# EAGLE design sequencer (EAGLE 6.4)
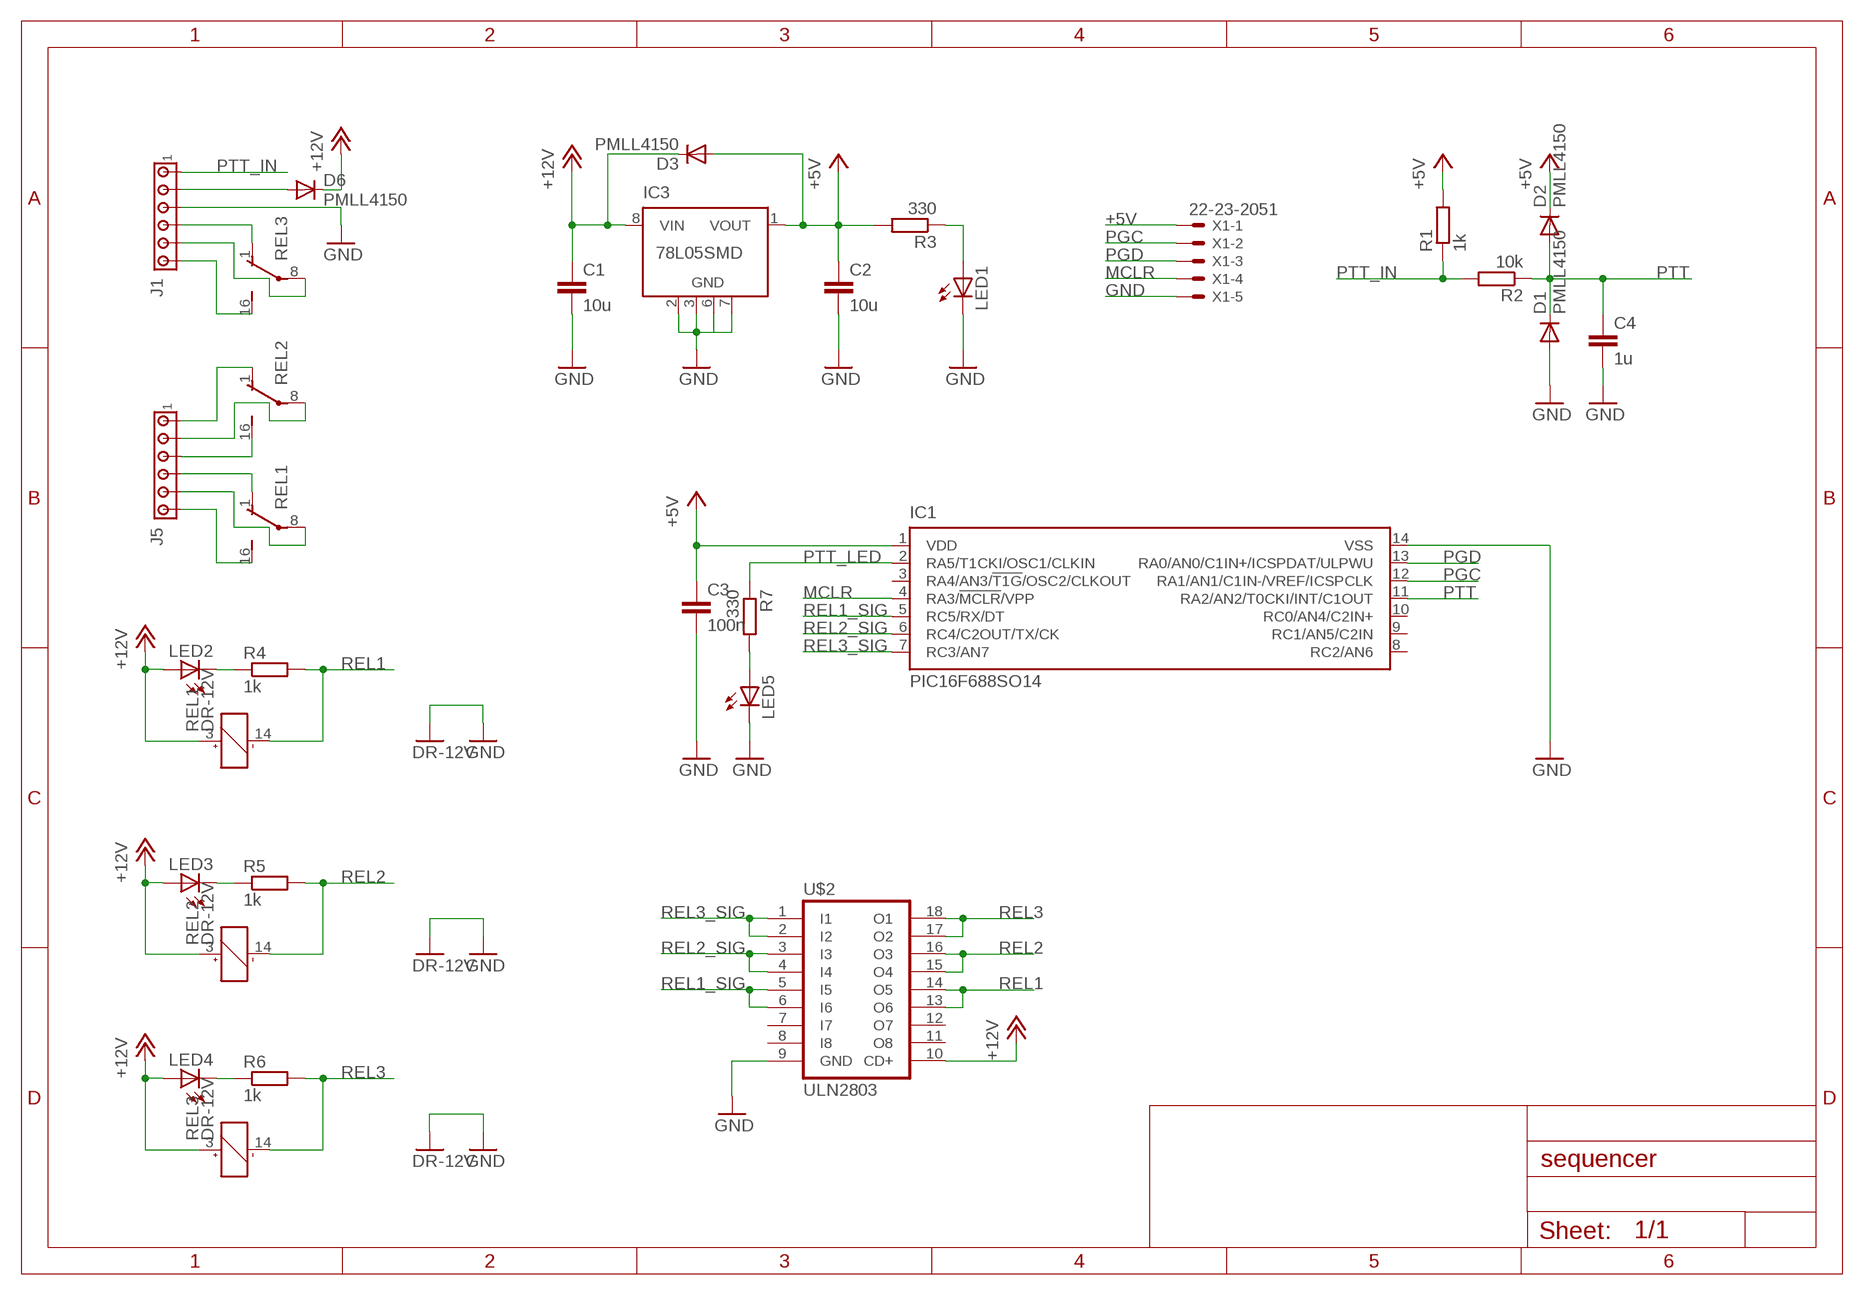
[diagram p0: schematic, sheet 1]

## Parts
C1  10u  CAPACITORC1206  [C1206]
C2  10u  CAPACITORC1206  [C1206]
C3  100n  CAPACITORC1206  [C1206]
C4  1u  CAPACITORC1206  [C1206]
D1  PMLL4150  [SOD80C]
D2  PMLL4150  [SOD80C]
D3  PMLL4150  [SOD80C]
D6  PMLL4150  [SOD80C]
IC1  PIC16F688SO14  [SO14]
IC3  78L05SMD  [SO08]
J1  SL508_6_90SL508_6_90  [SL508_6_90]
J5  SL508_6_90SL508_6_90  [SL508_6_90]
LED1  LEDSMT1206  [1206]
LED2  LEDSMT1206  [1206]
LED3  LEDSMT1206  [1206]
LED4  LEDSMT1206  [1206]
LED5  LEDSMT1206  [1206]
R1  1k  RESISTORR1206  [R1206]
R2  10k  RESISTORR1206  [R1206]
R3  330  RESISTORR1206  [R1206]
R4  1k  RESISTORR1206  [R1206]
R5  1k  RESISTORR1206  [R1206]
R6  1k  RESISTORR1206  [R1206]
R7  330  RESISTORR1206  [R1206]
REL1  DR-12V  [DR-12V]
REL2  DR-12V  [DR-12V]
REL3  DR-12V  [DR-12V]
U$2  ULN2803  [SO18W]
X1  22-23-2051  [22-23-2051]

## Nets
+5V: C2.1 C3.1 D2.C D3.A IC1.1(VDD) IC3.1(VOUT) R1.2 R3.2 X1.1
+12V: C1.1 D3.C D6.C IC3.8(VIN) LED2.A LED3.A LED4.A REL1.3(+) REL2.3(+) REL3.3(+) U$2.10(CD+)
GND: C1.2 C2.2 C3.2 C4.2 D1.A IC1.14(VSS) IC3.2(GND) IC3.3(GND) IC3.6(GND) IC3.7(GND) J1.3 LED1.C LED5.C REL1.9(GND) REL2.9(GND) REL3.9(GND) U$2.9(GND) X1.5
MCLR: IC1.4(RA3/!MCLR!/VPP) X1.4
N$1: J5.3 REL2.16(S)
N$2: J5.2 REL2.8(P)
N$3: J5.1 REL2.1(O)
N$4: J1.5 REL3.8(P)
N$5: J5.5 REL1.8(P)
N$6: J5.6 REL1.16(S)
N$7: J1.6 REL3.16(S)
N$8: J1.4 REL3.1(O)
N$9: D6.A J1.2
N$10: LED1.A R3.1
N$11: LED5.A R7.2
N$12: J5.4 REL1.1(O)
N$13: LED3.C R5.1
N$14: LED2.C R4.1
N$15: LED4.C R6.1
PGC: IC1.12(RA1/AN1/C1IN-/VREF/ICSPCLK) X1.2
PGD: IC1.13(RA0/AN0/C1IN+/ICSPDAT/ULPWU) X1.3
PTT: C4.1 D1.C D2.A IC1.11(RA2/AN2/T0CKI/INT/C1OUT) R2.1
PTT_IN: J1.1 R1.1 R2.2
PTT_LED: IC1.2(RA5/T1CKI/OSC1/CLKIN) R7.1
REL1: R4.2 REL1.14(-) U$2.13(O6) U$2.14(O5)
REL1_SIG: IC1.5(RC5/RX/DT) U$2.5(I5) U$2.6(I6)
REL2: R5.2 REL2.14(-) U$2.15(O4) U$2.16(O3)
REL2_SIG: IC1.6(RC4/C2OUT/TX/CK) U$2.3(I3) U$2.4(I4)
REL3: R6.2 REL3.14(-) U$2.17(O2) U$2.18(O1)
REL3_SIG: IC1.7(RC3/AN7) U$2.1(I1) U$2.2(I2)
Unconnected: IC1.3(RA4/AN3/!T1G!/OSC2/CLKOUT) IC1.8(RC2/AN6) IC1.9(RC1/AN5/C2IN) IC1.10(RC0/AN4/C2IN+) IC3.4(NC) IC3.5(NC) U$2.7(I7) U$2.8(I8) U$2.11(O8) U$2.12(O7)

## Library data of the parts
C1-C4 = 00MyParts:CAPACITOR: CAPACITOR, European symbol
D1-D3 D6 = diode:PMLL4150: DIODE high speed
IC1 = 00MyParts:PIC16F688
IC3 = linear:78L*SMD: Positive VOLTAGE REGULATOR
J1 J5 = 00MyParts:SL508_6_90: AMP connector
LED1-LED5 = led:LED: LED OSRAM: - CHIPLED LG R971, LG N971, LY N971, LG Q971, LY Q971, LO R971, LY R971 LH N974, LH R974 LS Q976, LO Q976, LY Q976 LO Q996 - Hyper CHIPLED LW Q18S LB Q993, LB Q99A, LB R99A - SideLED LS A670, LO A670, LY A670, LG A670, LP A670 LB A673, LV A673, LT A673, LW A673 LH A674 LY A675 LS A676, LA A676, LO A676, LY A676, LW A676 LS A679, LY A679, LG A679 - Hyper Micro SIDELED® LS Y876, LA Y876, LO Y876, LY Y876 LT Y87S - SmartLED LW L88C, LW L88S LB L89C, LB L89S, LG L890 LS L89K, LO L89K, LY L89K LS L896, LA L896, LO L896, LY L896 - TOPLED LS T670, LO T670, LY T670, LG T670, LP T670 LSG T670, LSP T670, LSY T670, LOP T670, LYG T670 LG T671, LOG T671, LSG T671 LB T673, LV T673, LT T673, LW T673 LH T674 LS T676, LA T676, LO T676, LY T676, LB T676, LH T676, LSB T676, LW T676 LB T67C, LV T67C, LT T67C, LS T67K, LO T67K, LY T67K, LW E67C LS E67B, LA E67B, LO E67B, LY E67B, LB E67C, LV E67C, LT E67C LW T67C LS T679, LY T679, LG T679 LS T770, LO T770, LY T770, LG T770, LP T770 LB T773, LV T773, LT T773, LW T773 LH T774 LS E675, LA E675, LY E675, LS T675 LS T776, LA T776, LO T776, LY T776, LB T776 LHGB T686 LT T68C, LB T68C - Hyper Mini TOPLED® LB M676 - Mini TOPLED Santana® LG M470 LS M47K, LO M47K, LY M47K Source: http://www.osram.convergy.de LUXEON: - LUMILED® LXK2-PW12-R00, LXK2-PW12-S00, LXK2-PW14-U00, LXK2-PW14-V00 LXK2-PM12-R00, LXK2-PM12-S00, LXK2-PM14-U00 LXK2-PE12-Q00, LXK2-PE12-R00, LXK2-PE12-S00, LXK2-PE14-T00, LXK2-PE14-U00 LXK2-PB12-K00, LXK2-PB12-L00, LXK2-PB12-M00, LXK2-PB14-N00, LXK2-PB14-P00, LXK2-PB14-Q00 LXK2-PR12-L00, LXK2-PR12-M00, LXK2-PR14-Q00, LXK2-PR14-R00 LXK2-PD12-Q00, LXK2-PD12-R00, LXK2-PD12-S00 LXK2-PH12-R00, LXK2-PH12-S00 LXK2-PL12-P00, LXK2-PL12-Q00, LXK2-PL12-R00 Source: www.luxeon.com KINGBRIGHT: KA-3528ASYC Source: www.kingbright.com
R1-R7 = 00MyParts:RESISTOR: RESISTOR, European symbol
REL1-REL3 = 00MyParts:DR-12V
U$2 = 00MyParts:ULN2803
X1 = 00MyParts:22-23-2051: .100" (2.54mm) Center Header - 5 Pin; MF: MOLEX; MPN: 22-23-2051; OC_FARNELL: 1462952; OC_NEWARK: 38C9178

## Board
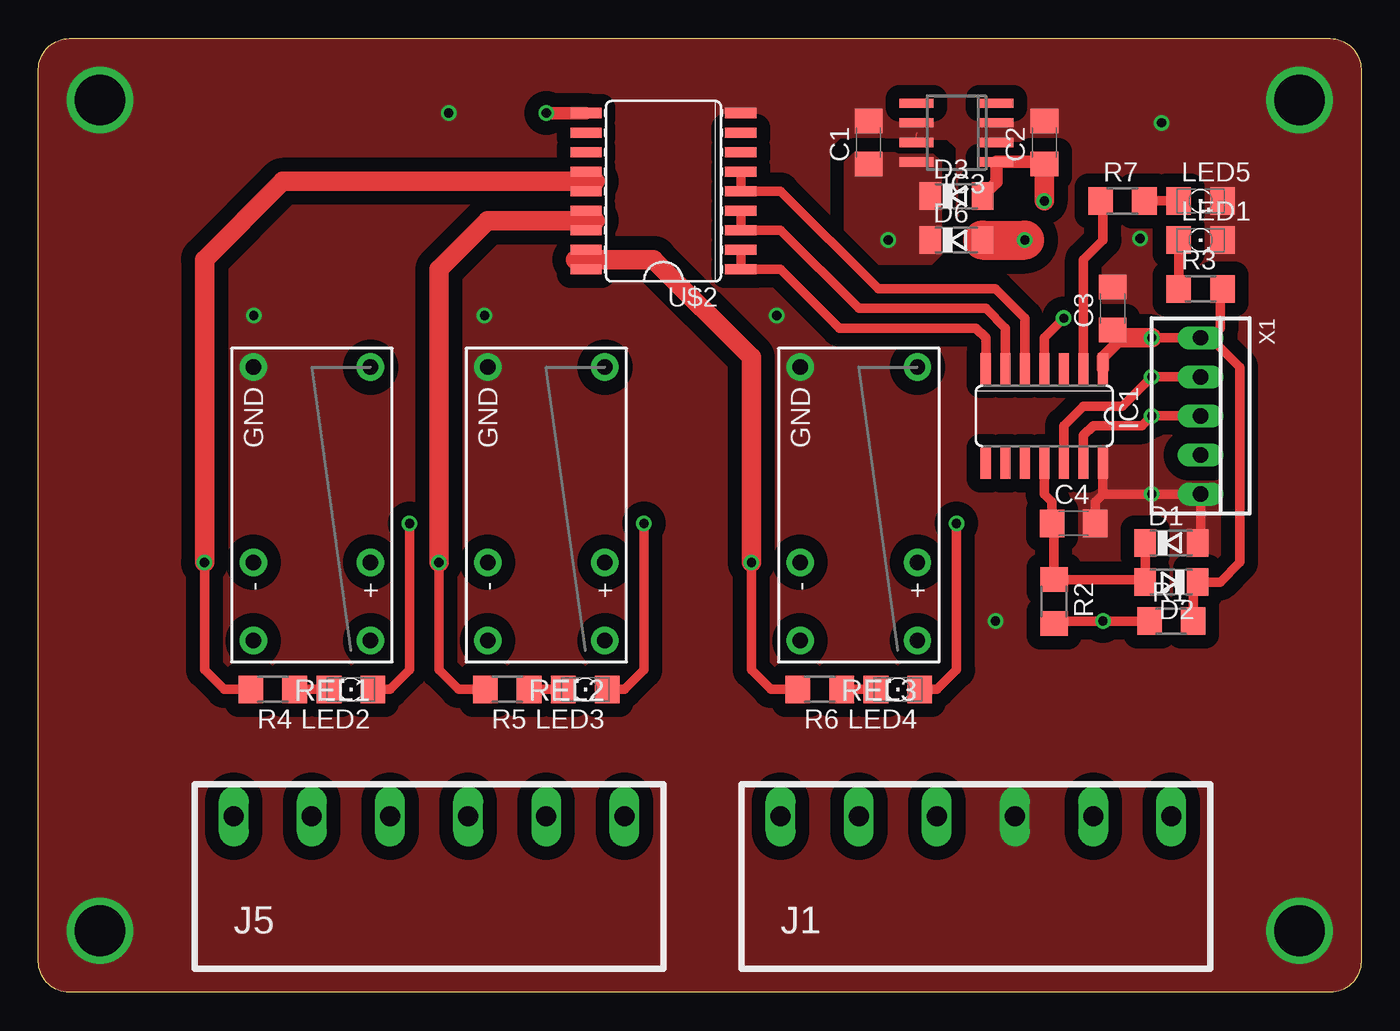
[diagram p1: board, top side]
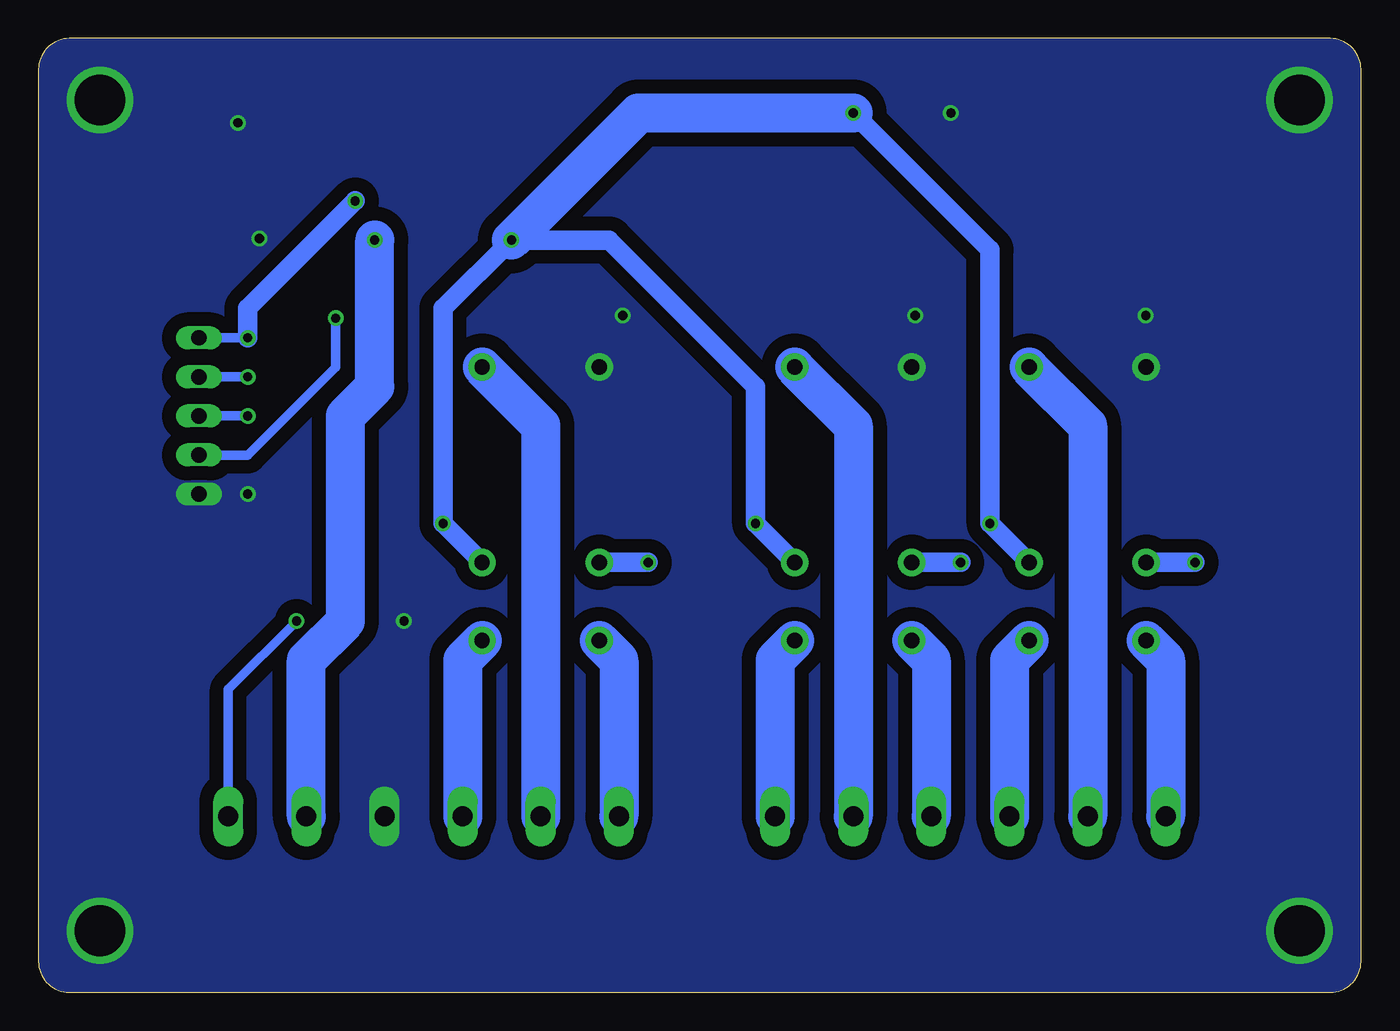
[diagram p2: board, bottom side, seen from below]

Size 86 x 62 mm. Coordinates in mm from the lower left corner, seen from the top.
Outline: 0,60 arc-90 2,62 84,62 arc-90 86,60 86,2 arc-90 84,0 2,0 arc-90 0,2 0,60
Copper layers (1*16): Top 0.035mm / dielectric 1.5mm / Bottom 0.035mm
Design rules "default *": minimum track width 10mil, minimum drill 0.6mm, track to track 16mil, track to pad 16mil, pad to pad 16mil, via to via 16mil, smd to smd 16mil, copper to edge 0mil, drill to drill 8mil, minimum pad ring 10mil, minimum via ring 8mil, stop-mask expansion 4mil, vias tented up to drill 0mil, thermal gap 10mil

### Footprints (pad centres in the part's own frame; a part is rotated, then mirrored left to right if it is on the bottom)
C1206 = smd 1.6 x 1.8: 1 -1.4,0; 2 1.4,0
SOD80C = smd 1.4 x 1.8: A 1.7,0; C -1.7,0
SO14 = smd 0.66 x 2.032: 1 -3.81,-3.073; 2 -2.54,-3.073; 3 -1.27,-3.073; 4 0,-3.073; 5 1.27,-3.073; 6 2.54,-3.073; 7 3.81,-3.073; 8 3.81,3.073; 9 2.54,3.073; 10 1.27,3.073; 11 0,3.073; 12 -1.27,3.073; 13 -2.54,3.073; 14 -3.81,3.073
SO08 = smd 0.6 x 2.2: 1 -1.905,-2.6; 2 -0.635,-2.6; 3 0.635,-2.6; 4 1.905,-2.6; 5 1.905,2.6; 6 0.635,2.6; 7 -0.635,2.6; 8 -1.905,2.6
SL508_6_90 = drill 1.3 long: 1 12.7,0; 2 7.62,0; 3 2.54,0; 4 -2.54,0; 5 -7.62,0; 6 -12.7,0
1206 = smd 1.6 x 1.803: A -1.422,0; C 1.422,0
R1206 = smd 1.6 x 1.803: 1 -1.422,0; 2 1.422,0
DR-12V = drill 1 pad 1.778: 1 -8.89,-3.81; 3 -3.81,-3.81; 8 8.89,-3.81; 9 8.89,3.81; 14 -3.81,3.81; 16 -8.89,3.81
SO18W = smd 0.66 x 2.032: 1 -5.08,-5.029; 2 -3.81,-5.029; 3 -2.54,-5.029; 4 -1.27,-5.029; 5 0,-5.029; 6 1.27,-5.029; 7 2.54,-5.029; 8 3.81,-5.029; 9 5.08,-5.029; 10 5.08,5.029; 11 3.81,5.029; 12 2.54,5.029; 13 1.27,5.029; 14 0,5.029; 15 -1.27,5.029; 16 -2.54,5.029; 17 -3.81,5.029; 18 -5.08,5.029
22-23-2051 = drill 1 long: 1 -5.08,0; 2 -2.54,0; 3 0,0; 4 2.54,0; 5 5.08,0

### Placement (x,y rotation side)
C1  53.98,55.24 90 top
C2  65.41,55.24 90 top
C3  69.85,44.45 90 top
C4  67.31,30.48 0 top
D1  73.66,29.21 0 top
D2  73.66,26.67 180 top
D3  59.69,51.75 0 top
D6  59.69,48.9 0 top
IC1  65.41,37.47 180 top
IC3  59.69,55.88 90 top
J1  60.96,11.43 0 top
J5  25.4,11.43 0 top
LED1  75.56,48.9 0 top
LED2  20.32,19.68 180 top
LED3  35.56,19.68 180 top
LED4  55.88,19.68 180 top
LED5  75.56,51.44 0 top
R1  73.66,24.13 0 top
R2  66.04,25.4 270 top
R3  75.56,45.72 0 top
R4  15.24,19.68 180 top
R5  30.48,19.68 180 top
R6  50.8,19.68 180 top
R7  70.48,51.44 0 top
REL1  17.78,31.75 90 top
REL2  33.02,31.75 90 top
REL3  53.34,31.75 90 top
U$2  40.64,52.07 90 top
X1  75.56,37.47 270 top

### Tracks (layer width: path | path; a pad name or v marks a point on that pad's centre or on a via)
+5V  (via drill 0.6)
  Top 0.61: v72.39,42.55 X1.1 76.2,42.55 | 69.34,43.18 C3.1 | 76.2,42.55 76.83,43.18 76.83,45.57 R3.2 | R1.2 75.08,26.39 D2.C 76.83,26.67 78.11,27.94 78.11,40.64 76.2,42.55
  Top 0.813: D3.A 62.29,52.65 IC3.1 64.9,53.98 C2.1 | IC1.1 69.22,41.27 70.48,42.55
  Top 1.27: v72.39,42.55 70.48,42.55 70.36,42.55 C3.1 | C2.1 v65.41,51.44
  Bottom 0.61: X1.1 v72.39,42.55
  Bottom 1.27: v65.41,51.44 72.39,44.45 v72.39,42.55
+12V  (via drill 0.6)
  Top 0.61: v24.13,30.48 24.13,20.95 22.86,19.68 LED2.A | LED3.A 38.1,19.68 39.37,20.95 v39.37,30.48 | LED4.A 58.42,19.68 59.69,20.95 v59.69,30.48
  Top 0.813: 54.48,53.98 C1.1 | U$2.10 v33.02,57.15
  Bottom 1.27: REL1.3 v24.13,30.48 24.13,48.26 v33.02,57.15 | REL2.3 v39.37,30.48 39.37,39.37 48.9,48.9 v55.24,48.9 59.69,44.45 v59.69,30.48 REL3.3
  Bottom 2.54: v33.02,57.15 46.99,57.15 v55.24,48.9
  pour Top (isolate 0.406, no thermals): 53.02,54.61 58.1,54.61 58.74,53.98 58.74,47.94 58.1,47.31 54.61,47.31 52.39,49.53 52.39,53.98
GND  (via drill 0.6, 3.3)
  Top 0: IC3.7 57.09,55.82 57.15,55.88
  Top 0.61: C4.2 68.71,31.88 69.22,32.38 | 69.22,32.38 IC1.14 | D1.A 75.56,29.41 X1.5 v72.39,32.38 69.22,32.38
  Top 0.813: 54.1,56.52 C1.2 | 65.28,56.52 C2.2
  other vias: 4,58 82,4 4,4 82,58 71.64,49 14,44 29,44 48,44 62.23,24.13 26.67,57.15 73.03,56.52
  pour Bottom (isolate 0.9, no thermals): 2,62 84,62 arc-90 86,60 86,2 arc-90 84,0 2,0 arc-90 0,2 0,60 arc-90
  pour Top (isolate 0.9, rank 2, no thermals): 2,62 84,62 arc-90 86,60 86,2 arc-90 84,0 2,0 arc-90 0,2 0,60 arc-90
MCLR  (via drill 0.6)
  Top 0.61: IC1.4 65.41,42.55 v66.67,43.81
  Bottom 0.61: v66.67,43.81 66.67,40.64 72.39,34.92 X1.4
N$1
  Bottom 2.54: REL2.16 27.94,21.59 J5.3
N$2
  Bottom 2.54: REL2.8 33.02,36.83 J5.2
N$3
  Bottom 2.54: REL2.1 38.1,21.59 J5.1
N$4
  Bottom 2.54: REL3.8 53.34,36.83 J1.5
N$5
  Bottom 2.54: REL1.8 17.78,36.83 J5.5
N$6
  Bottom 2.54: REL1.16 12.7,21.59 J5.6
N$7
  Bottom 2.54: REL3.16 48.26,21.59 J1.6
N$8
  Bottom 2.54: REL3.1 58.42,21.59 J1.4
N$9  (via drill 0.6)
  Top 2.54: D6.A v64.14,48.9
  Bottom 2.54: J1.2 68.58,21.59 66.04,24.13 66.04,37.47 64.14,39.37 v64.14,48.9
N$10
  Top 0.61: R3.1 LED1.A
N$11
  Top 0.61: LED5.A R7.2
N$12
  Bottom 2.54: REL1.1 22.86,21.59 J5.4
N$13
  Top 0.61: LED3.C R5.1
N$14
  Top 0.61: LED2.C R4.1
N$15
  Top 0.61: R6.1 LED4.C
PGC  (via drill 0.6)
  Top 0.61: IC1.12 66.67,36.83 67.94,38.1 70.48,38.1 v72.39,40.01 X1.2
  Bottom 0.61: v72.39,40.01 X1.2
PGD  (via drill 0.6)
  Top 0.61: IC1.13 67.94,36.2 68.58,36.83 71.75,36.83 v72.39,37.47 X1.3
  Bottom 0.61: X1.3 v72.39,37.47
PTT
  Top 0.61: D1.C D2.A 71.81,26.82 R2.1 66.04,30.35 C4.1 65.91,31.88 65.41,32.38 IC1.11
PTT_IN  (via drill 0.6)
  Top 0.61: R1.1 v69.22,24.13 66.19,24.13 R2.2
  Bottom 0.61: J1.1 73.66,19.68 v69.22,24.13
PTT_LED
  Top 0.61: 68.58,51.44 R7.1 69.22,51.28 69.22,48.9 67.94,47.62 IC1.2
REL1  (via drill 0.6)
  Top 0.61: R4.2 12.06,19.68 10.79,20.95 v10.79,27.94 | U$2.14 U$2.13 35.61,52.76 35.56,52.7
  Top 1.27: 36.2,52.7 35.56,52.7 15.88,52.7 10.79,47.62 v10.79,27.94
  Bottom 1.27: REL1.14 v10.79,27.94
REL1_SIG
  Top 0.61: IC1.5 64.14,43.81 62.23,45.72 54.61,45.72 48.26,52.07 U$2.5 U$2.6
REL2  (via drill 0.6)
  Top 0.61: R5.2 27.3,19.68 26.04,20.95 v26.04,27.94 | U$2.16 U$2.15 35.61,50.75 36.2,50.16
  Top 1.27: v26.04,27.94 26.04,46.99 29.21,50.16 36.2,50.16
  Bottom 1.27: REL2.14 v26.04,27.94
REL2_SIG
  Top 0.61: U$2.4 U$2.3 48.26,49.53 53.34,44.45 61.59,44.45 62.87,43.18 IC1.6
REL3  (via drill 0.6)
  Top 0.61: R6.2 47.62,19.68 46.35,20.95 v46.35,27.94 | U$2.17 35.56,48.26 34.92,47.62 34.98,47.62 U$2.18
  Top 1.27: v46.35,27.94 46.35,41.27 40.01,47.62 34.92,47.62
  Bottom 1.27: REL3.14 v46.35,27.94
REL3_SIG
  Top 0.61: U$2.2 U$2.1 48.26,46.99 52.07,43.18 60.96,43.18 61.59,42.55 IC1.7

### Text on the board
tText: PTT | PWR | VCC | PGC | PGD | CLR | GND | Sequencer | HB9BBD 2013 | Preamp | Amplifier | Relais | GND | 12V | PTT